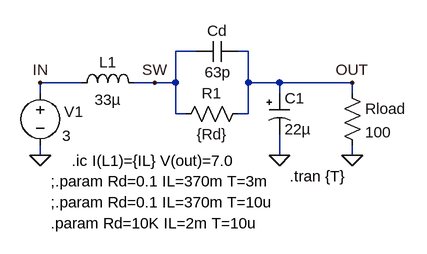
[diagram p0: schematic StepUpRevers1.asc]
StepUpRevers1.asc, the LTspice schematic file:
Version 4
SHEET 1 2376 1416
WIRE 1696 896 1664 896
WIRE 1776 896 1760 896
WIRE 1520 944 1456 944
WIRE 1632 944 1600 944
WIRE 1664 944 1664 896
WIRE 1664 944 1632 944
WIRE 1776 944 1776 896
WIRE 1824 944 1776 944
WIRE 1936 944 1824 944
WIRE 1456 960 1456 944
WIRE 1824 960 1824 944
WIRE 1936 960 1936 944
WIRE 1664 992 1664 944
WIRE 1680 992 1664 992
WIRE 1776 992 1776 944
WIRE 1776 992 1760 992
WIRE 1456 1056 1456 1040
WIRE 1824 1056 1824 1024
WIRE 1936 1056 1936 1040
FLAG 1936 944 OUT
FLAG 1824 1056 0
FLAG 1936 1056 0
FLAG 1456 1056 0
FLAG 1456 944 IN
FLAG 1632 944 SW
SYMBOL VOLTAGE 1456 944 R0
WINDOW 123 0 0 Left 0
WINDOW 0 37 45 Left 0
WINDOW 3 34 82 Left 0
SYMATTR InstName V1
SYMATTR Value 3
SYMATTR SpiceLine Rser=0.1
SYMBOL POLCAP 1808 960 R0
SYMATTR InstName C1
SYMATTR Value 22µ
SYMATTR SpiceLine Rser=0.02
SYMBOL IND 1504 960 R270
WINDOW 0 32 56 VTop 0
WINDOW 3 5 56 VBottom 0
SYMATTR InstName L1
SYMATTR Value 33µ
SYMATTR SpiceLine Rser=0.02 Rpar=5000
SYMBOL res 1920 944 R0
SYMATTR InstName Rload
SYMATTR Value 100
SYMBOL cap 1760 880 R90
WINDOW 0 0 32 VBottom 0
WINDOW 3 32 31 VTop 0
SYMATTR InstName Cd
SYMATTR Value 63p
SYMBOL res 1776 976 R90
WINDOW 0 0 56 VBottom 0
WINDOW 3 32 56 VTop 0
SYMATTR InstName R1
SYMATTR Value {Rd}
TEXT 1840 1088 Left 0 !.tran {T}
TEXT 1504 1064 Left 0 !.ic I(L1)={IL} V(out)=7.0
TEXT 1472 1160 Left 0 !.param Rd=10K IL=2m T=10u
TEXT 1472 1128 Left 0 !;.param Rd=0.1 IL=370m T=10u
TEXT 1472 1096 Left 0 !;.param Rd=0.1 IL=370m T=3m

The netlist it stands for:
* StepUpRevers1.asc
V1 IN 0 3 Rser=0.1
C1 OUT 0 22µ Rser=0.02
L1 IN SW 33µ Rser=0.02 Rpar=5000
Rload OUT 0 100
Cd OUT SW 63p
R1 OUT SW {Rd}
.tran {T}
.ic I(L1)={IL} V(out)=7.0
.param Rd=10K IL=2m T=10u
;.param Rd=0.1 IL=370m T=10u
;.param Rd=0.1 IL=370m T=3m
.backanno
.end